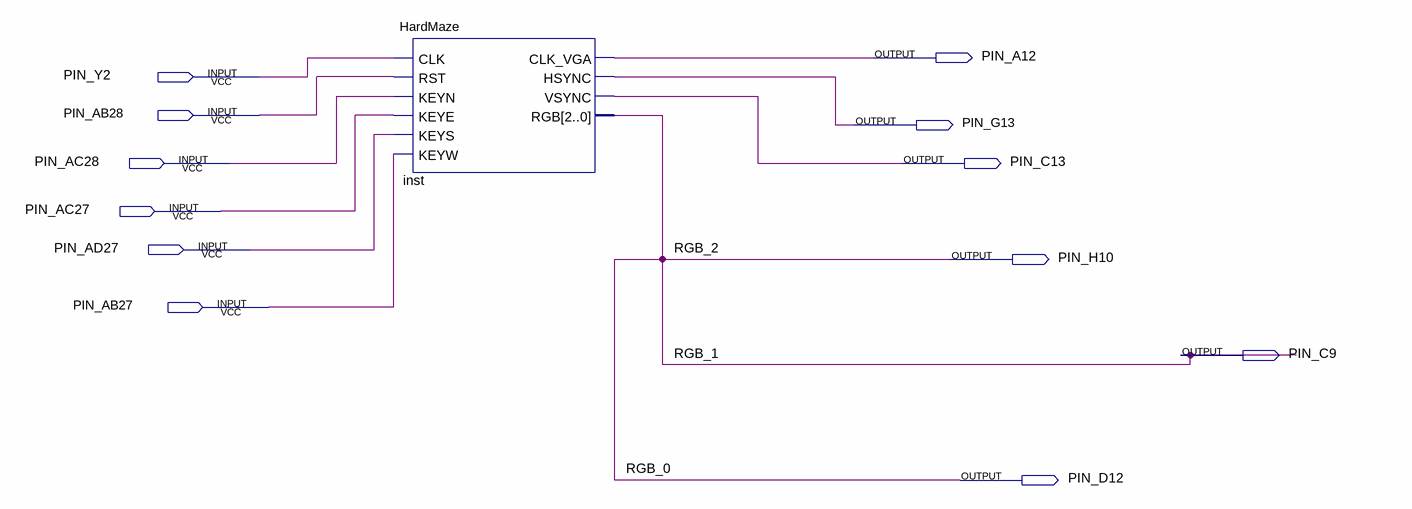
[diagram p0: schematic sheet]
// Quartus schematic HardMaze.bdf as structural Verilog: 1 symbols, 12 pins
module HardMaze (
  input  PIN_Y2,
  input  PIN_AB28,
  input  PIN_AC28,
  input  PIN_AC27,
  input  PIN_AD27,
  input  PIN_AB27,
  output PIN_A12,
  output PIN_G13,
  output PIN_C13,
  output PIN_H10,
  output PIN_C9,
  output PIN_D12
);

  HardMaze inst (
    .CLK(PIN_Y2), .RST(PIN_AB28), .KEYN(PIN_AC28), .KEYE(PIN_AC27), .KEYS(PIN_AD27), .KEYW(PIN_AB27),
    .CLK_VGA(PIN_A12), .HSYNC(PIN_G13), .VSYNC(PIN_C13), .RGB(PIN_C9));

  assign PIN_D12 = PIN_C9;
  assign PIN_H10 = PIN_C9;

  // Other names for the same wires on the sheet: RGB_0 = PIN_C9; RGB_1 = PIN_C9; RGB_2 = PIN_C9
endmodule
